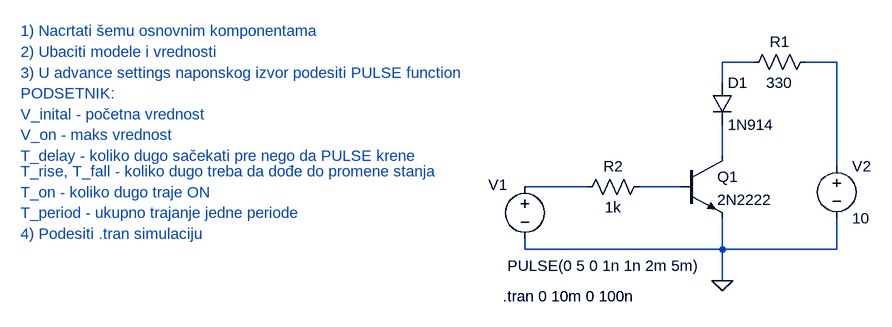
[diagram p0: schematic V1_PULSE.asc]
V1_PULSE.asc, the LTspice schematic file:
Version 4
SHEET 1 880 680
WIRE 256 -48 208 -48
WIRE 384 -48 336 -48
WIRE 208 -16 208 -48
WIRE 208 96 208 48
WIRE 384 112 384 -48
WIRE 0 144 -96 144
WIRE 144 144 80 144
WIRE -96 240 -96 224
WIRE 208 240 208 192
WIRE 208 240 -96 240
WIRE 384 240 384 192
WIRE 384 240 208 240
WIRE 208 288 208 240
FLAG 208 288 0
SYMBOL voltage -96 128 R0
WINDOW 0 -56 13 Left 2
WINDOW 3 -27 137 Left 2
WINDOW 123 0 0 Left 0
WINDOW 39 0 0 Left 0
SYMATTR InstName V1
SYMATTR Value PULSE(0 5 0 1n 1n 2m 5m)
SYMBOL voltage 384 96 R0
WINDOW 123 0 0 Left 0
WINDOW 39 0 0 Left 0
SYMATTR InstName V2
SYMATTR Value 10
SYMBOL npn 144 96 R0
SYMATTR InstName Q1
SYMATTR Value 2N2222
SYMBOL diode 192 -16 R0
SYMATTR InstName D1
SYMATTR Value 1N914
SYMBOL res 352 -64 R90
WINDOW 0 0 56 VBottom 2
WINDOW 3 32 56 VTop 2
SYMATTR InstName R1
SYMATTR Value 330
SYMBOL res 96 128 R90
WINDOW 0 0 56 VBottom 2
WINDOW 3 32 56 VTop 2
SYMATTR InstName R2
SYMATTR Value 1k
TEXT -130 312 Left 2 !.tran 0 10m 0 100n
TEXT -872 -96 Left 2 ;1) Nacrtati šemu osnovnim komponentama
TEXT -872 -64 Left 2 ;2) Ubaciti modele i vrednosti
TEXT -872 -32 Left 2 ;3) U advance settings naponskog izvor podesiti PULSE function
TEXT -872 0 Left 2 ;PODSETNIK:
TEXT -872 32 Left 2 ;V_inital - početna vrednost
TEXT -872 64 Left 2 ;V_on - maks vrednost
TEXT -872 96 Left 2 ;T_delay - koliko dugo sačekati pre nego da PULSE krene
TEXT -872 120 Left 2 ;T_rise, T_fall - koliko dugo treba da dođe do promene stanja
TEXT -872 152 Left 2 ;T_on - koliko dugo traje ON
TEXT -872 184 Left 2 ;T_period - ukupno trajanje jedne periode
TEXT -872 216 Left 2 ;4) Podesiti .tran simulaciju

The netlist it stands for:
* V1_PULSE.asc
V1 N004 0 PULSE(0 5 0 1n 1n 2m 5m)
V2 N002 0 10
Q1 N003 N005 0 0 2N2222
D1 N001 N003 1N914
R1 N002 N001 330
R2 N005 N004 1k
.model D D
.lib standard.dio
.model NPN NPN
.model PNP PNP
.lib standard.bjt
.tran 0 10m 0 100n
* 1) Nacrtati šemu osnovnim komponentama
* 2) Ubaciti modele i vrednosti
* 3) U advance settings naponskog izvor podesiti PULSE function
* PODSETNIK:
* V_inital - početna vrednost
* V_on - maks vrednost
* T_delay - koliko dugo sačekati pre nego da PULSE krene
* T_rise, T_fall - koliko dugo treba da dođe do promene stanja
* T_on - koliko dugo traje ON
* T_period - ukupno trajanje jedne periode
* 4) Podesiti .tran simulaciju
.backanno
.end